# EasyEDA schematic 1-Schematic_Volumetric_Display.json
TITLE: Volumetric LED Matrix; REV: 1.0; Date: 2025-08-06; Sheet: 1/1; Drawn By: MoritzK; Company: Samsung Energy
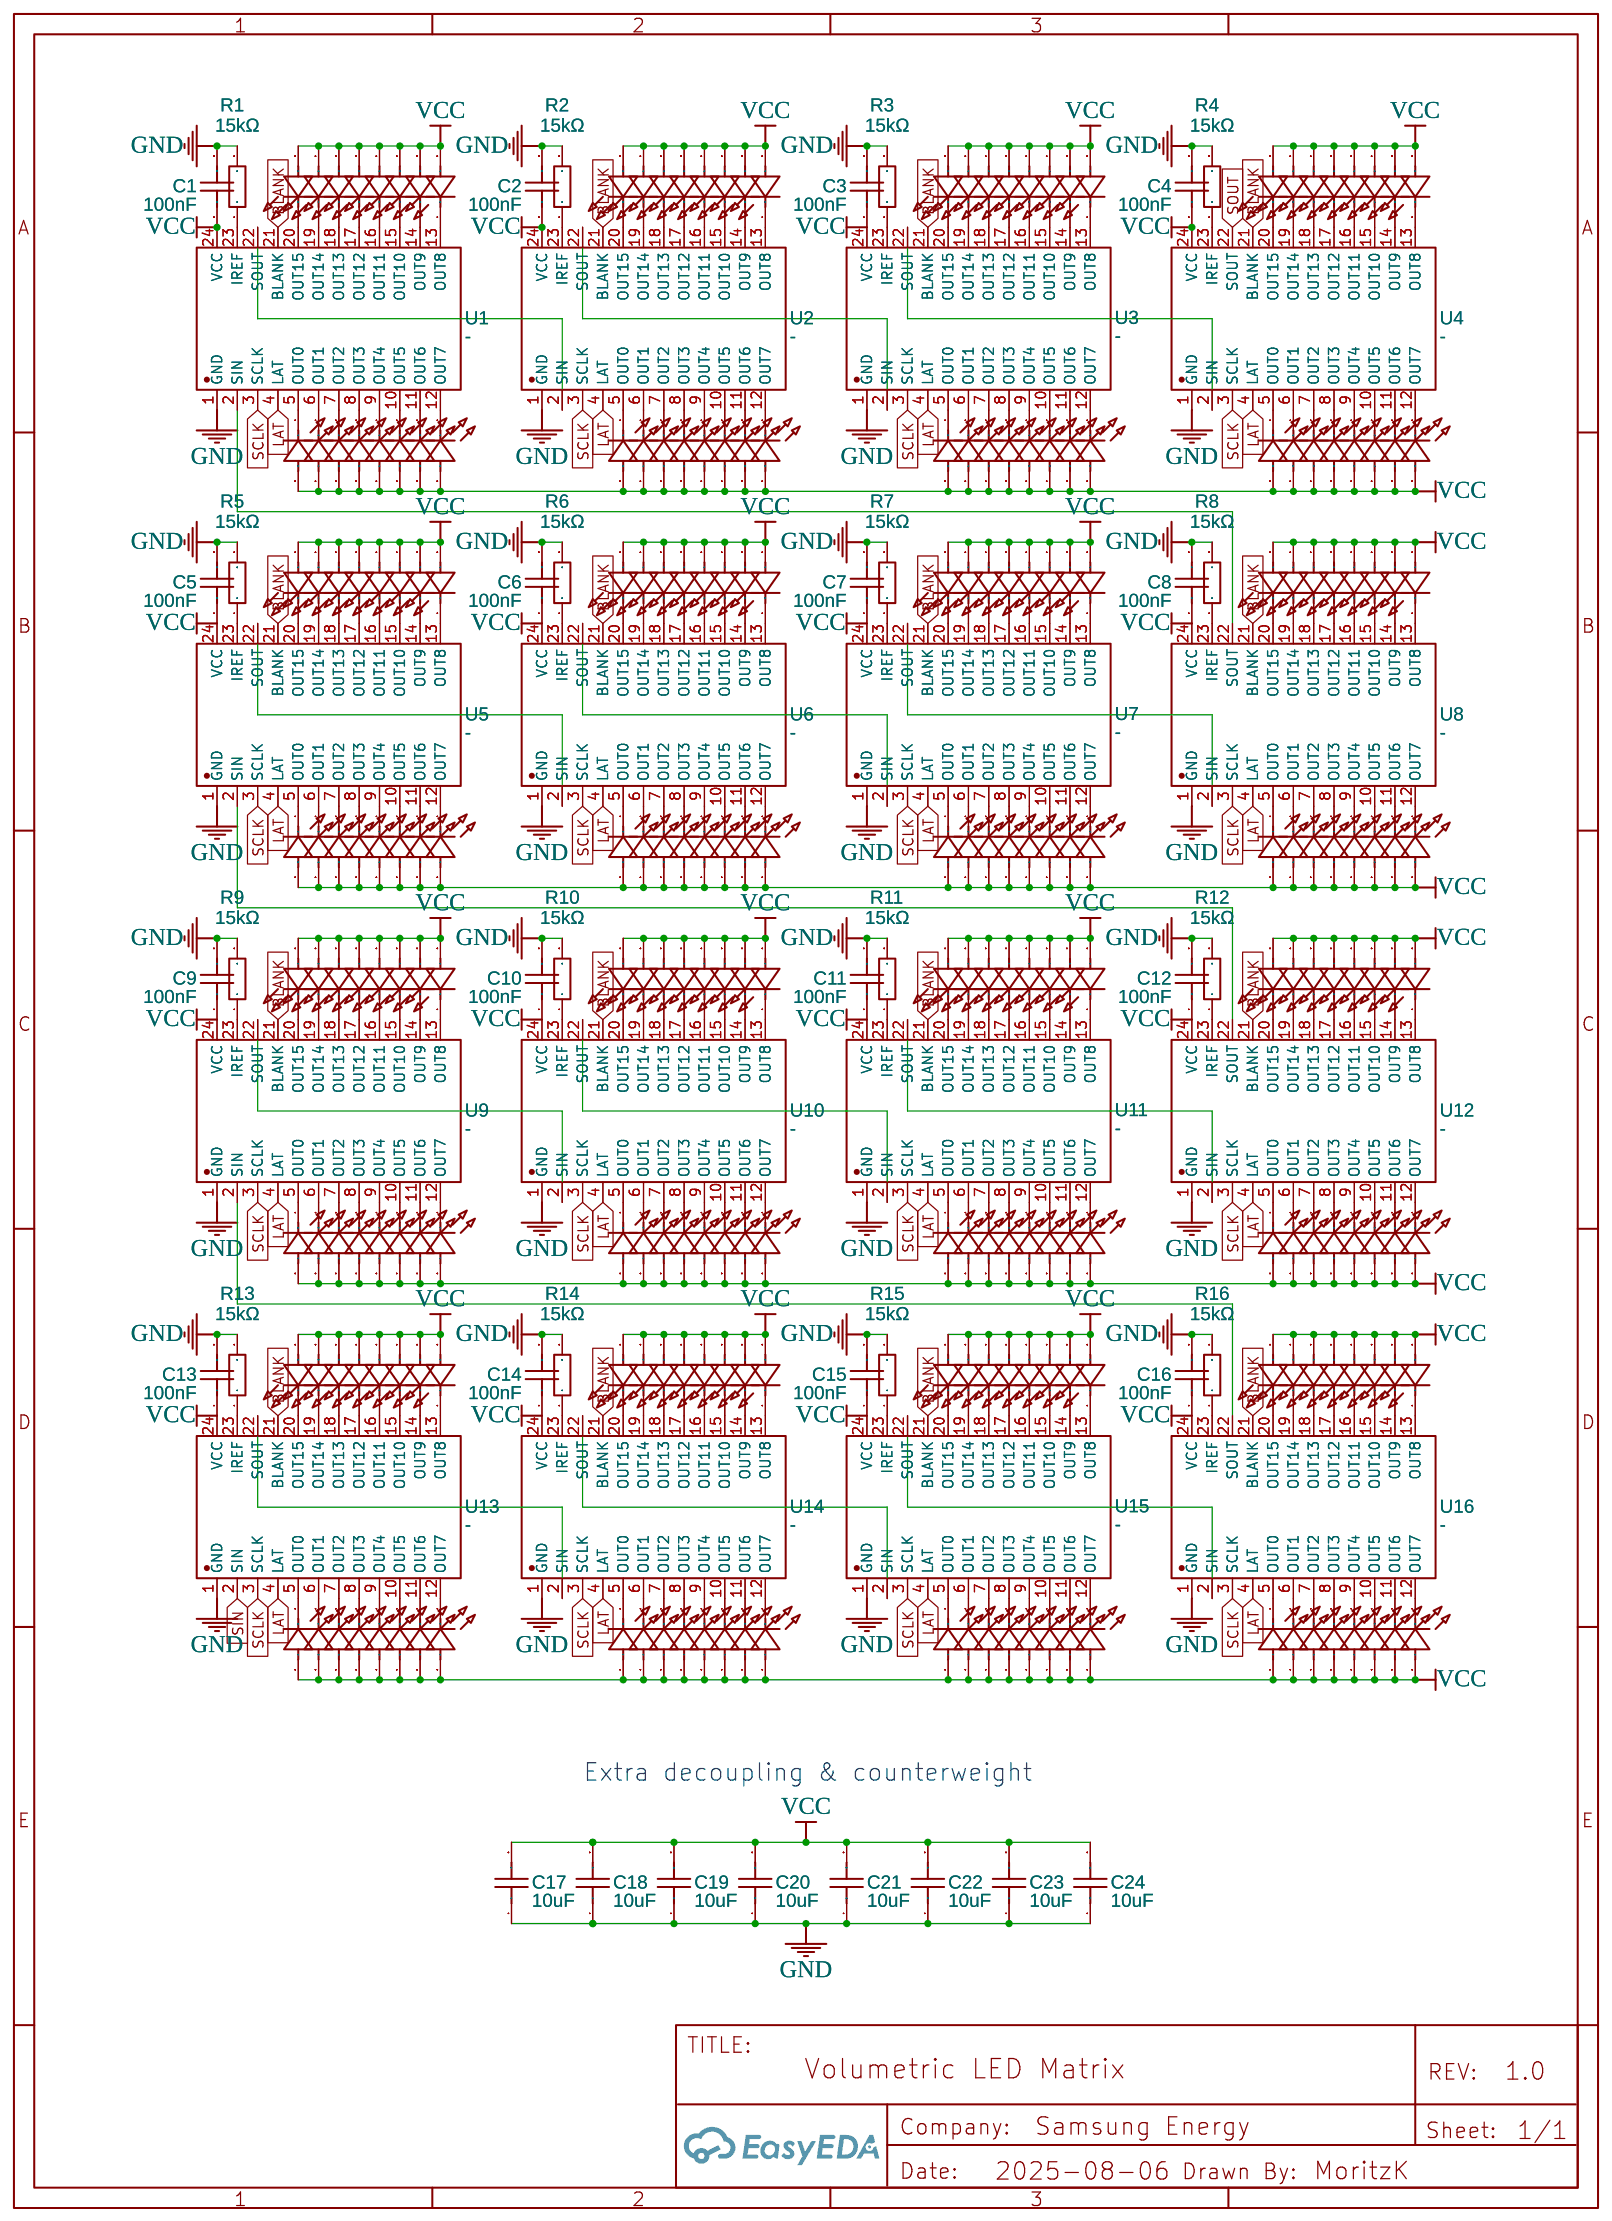
[diagram p0: schematic sheet]

## Parts
C1  100nF  [C0603]
C2  100nF  [C0603]
C3  100nF  [C0603]
C4  100nF  [C0603]
C5  100nF  [C0603]
C6  100nF  [C0603]
C7  100nF  [C0603]
C8  100nF  [C0603]
C9  100nF  [C0603]
C10  100nF  [C0603]
C11  100nF  [C0603]
C12  100nF  [C0603]
C13  100nF  [C0603]
C14  100nF  [C0603]
C15  100nF  [C0603]
C16  100nF  [C0603]
C17  10uF  [C0603]
C18  10uF  [C0603]
C19  10uF  [C0603]
C20  10uF  [C0603]
C21  10uF  [C0603]
C22  10uF  [C0603]
C23  10uF  [C0603]
C24  10uF  [C0603]
LED1  F.0603.00106/P2-0603W7YS2-06T-001  [LED0603-RD]
LED2  F.0603.00106/P2-0603W7YS2-06T-001  [LED0603-RD]
LED3  F.0603.00106/P2-0603W7YS2-06T-001  [LED0603-RD]
LED4  F.0603.00106/P2-0603W7YS2-06T-001  [LED0603-RD]
LED5  F.0603.00106/P2-0603W7YS2-06T-001  [LED0603-RD]
LED6  F.0603.00106/P2-0603W7YS2-06T-001  [LED0603-RD]
LED7  F.0603.00106/P2-0603W7YS2-06T-001  [LED0603-RD]
LED8  F.0603.00106/P2-0603W7YS2-06T-001  [LED0603-RD]
LED9  F.0603.00106/P2-0603W7YS2-06T-001  [LED0603-RD]
LED10  F.0603.00106/P2-0603W7YS2-06T-001  [LED0603-RD]
LED11  F.0603.00106/P2-0603W7YS2-06T-001  [LED0603-RD]
LED12  F.0603.00106/P2-0603W7YS2-06T-001  [LED0603-RD]
LED13  F.0603.00106/P2-0603W7YS2-06T-001  [LED0603-RD]
LED14  F.0603.00106/P2-0603W7YS2-06T-001  [LED0603-RD]
LED15  F.0603.00106/P2-0603W7YS2-06T-001  [LED0603-RD]
LED16  F.0603.00106/P2-0603W7YS2-06T-001  [LED0603-RD]
LED17  F.0603.00106/P2-0603W7YS2-06T-001  [LED0603-RD]
LED18  F.0603.00106/P2-0603W7YS2-06T-001  [LED0603-RD]
LED19  F.0603.00106/P2-0603W7YS2-06T-001  [LED0603-RD]
LED20  F.0603.00106/P2-0603W7YS2-06T-001  [LED0603-RD]
LED21  F.0603.00106/P2-0603W7YS2-06T-001  [LED0603-RD]
LED22  F.0603.00106/P2-0603W7YS2-06T-001  [LED0603-RD]
LED23  F.0603.00106/P2-0603W7YS2-06T-001  [LED0603-RD]
LED24  F.0603.00106/P2-0603W7YS2-06T-001  [LED0603-RD]
LED25  F.0603.00106/P2-0603W7YS2-06T-001  [LED0603-RD]
LED26  F.0603.00106/P2-0603W7YS2-06T-001  [LED0603-RD]
LED27  F.0603.00106/P2-0603W7YS2-06T-001  [LED0603-RD]
LED28  F.0603.00106/P2-0603W7YS2-06T-001  [LED0603-RD]
LED29  F.0603.00106/P2-0603W7YS2-06T-001  [LED0603-RD]
LED30  F.0603.00106/P2-0603W7YS2-06T-001  [LED0603-RD]
LED31  F.0603.00106/P2-0603W7YS2-06T-001  [LED0603-RD]
LED32  F.0603.00106/P2-0603W7YS2-06T-001  [LED0603-RD]
LED33  F.0603.00106/P2-0603W7YS2-06T-001  [LED0603-RD]
LED34  F.0603.00106/P2-0603W7YS2-06T-001  [LED0603-RD]
LED35  F.0603.00106/P2-0603W7YS2-06T-001  [LED0603-RD]
LED36  F.0603.00106/P2-0603W7YS2-06T-001  [LED0603-RD]
LED37  F.0603.00106/P2-0603W7YS2-06T-001  [LED0603-RD]
LED38  F.0603.00106/P2-0603W7YS2-06T-001  [LED0603-RD]
LED39  F.0603.00106/P2-0603W7YS2-06T-001  [LED0603-RD]
LED40  F.0603.00106/P2-0603W7YS2-06T-001  [LED0603-RD]
LED41  F.0603.00106/P2-0603W7YS2-06T-001  [LED0603-RD]
LED42  F.0603.00106/P2-0603W7YS2-06T-001  [LED0603-RD]
LED43  F.0603.00106/P2-0603W7YS2-06T-001  [LED0603-RD]
LED44  F.0603.00106/P2-0603W7YS2-06T-001  [LED0603-RD]
LED45  F.0603.00106/P2-0603W7YS2-06T-001  [LED0603-RD]
LED46  F.0603.00106/P2-0603W7YS2-06T-001  [LED0603-RD]
LED47  F.0603.00106/P2-0603W7YS2-06T-001  [LED0603-RD]
LED48  F.0603.00106/P2-0603W7YS2-06T-001  [LED0603-RD]
LED49  F.0603.00106/P2-0603W7YS2-06T-001  [LED0603-RD]
LED50  F.0603.00106/P2-0603W7YS2-06T-001  [LED0603-RD]
LED51  F.0603.00106/P2-0603W7YS2-06T-001  [LED0603-RD]
LED52  F.0603.00106/P2-0603W7YS2-06T-001  [LED0603-RD]
LED53  F.0603.00106/P2-0603W7YS2-06T-001  [LED0603-RD]
LED54  F.0603.00106/P2-0603W7YS2-06T-001  [LED0603-RD]
LED55  F.0603.00106/P2-0603W7YS2-06T-001  [LED0603-RD]
LED56  F.0603.00106/P2-0603W7YS2-06T-001  [LED0603-RD]
LED57  F.0603.00106/P2-0603W7YS2-06T-001  [LED0603-RD]
LED58  F.0603.00106/P2-0603W7YS2-06T-001  [LED0603-RD]
LED59  F.0603.00106/P2-0603W7YS2-06T-001  [LED0603-RD]
LED60  F.0603.00106/P2-0603W7YS2-06T-001  [LED0603-RD]
LED61  F.0603.00106/P2-0603W7YS2-06T-001  [LED0603-RD]
LED62  F.0603.00106/P2-0603W7YS2-06T-001  [LED0603-RD]
LED63  F.0603.00106/P2-0603W7YS2-06T-001  [LED0603-RD]
LED64  F.0603.00106/P2-0603W7YS2-06T-001  [LED0603-RD]
LED65  F.0603.00106/P2-0603W7YS2-06T-001  [LED0603-RD]
LED66  F.0603.00106/P2-0603W7YS2-06T-001  [LED0603-RD]
LED67  F.0603.00106/P2-0603W7YS2-06T-001  [LED0603-RD]
LED68  F.0603.00106/P2-0603W7YS2-06T-001  [LED0603-RD]
LED69  F.0603.00106/P2-0603W7YS2-06T-001  [LED0603-RD]
LED70  F.0603.00106/P2-0603W7YS2-06T-001  [LED0603-RD]
LED71  F.0603.00106/P2-0603W7YS2-06T-001  [LED0603-RD]
LED72  F.0603.00106/P2-0603W7YS2-06T-001  [LED0603-RD]
LED73  F.0603.00106/P2-0603W7YS2-06T-001  [LED0603-RD]
LED74  F.0603.00106/P2-0603W7YS2-06T-001  [LED0603-RD]
LED75  F.0603.00106/P2-0603W7YS2-06T-001  [LED0603-RD]
LED76  F.0603.00106/P2-0603W7YS2-06T-001  [LED0603-RD]
LED77  F.0603.00106/P2-0603W7YS2-06T-001  [LED0603-RD]
LED78  F.0603.00106/P2-0603W7YS2-06T-001  [LED0603-RD]
LED79  F.0603.00106/P2-0603W7YS2-06T-001  [LED0603-RD]
LED80  F.0603.00106/P2-0603W7YS2-06T-001  [LED0603-RD]
LED81  F.0603.00106/P2-0603W7YS2-06T-001  [LED0603-RD]
LED82  F.0603.00106/P2-0603W7YS2-06T-001  [LED0603-RD]
LED83  F.0603.00106/P2-0603W7YS2-06T-001  [LED0603-RD]
LED84  F.0603.00106/P2-0603W7YS2-06T-001  [LED0603-RD]
LED85  F.0603.00106/P2-0603W7YS2-06T-001  [LED0603-RD]
LED86  F.0603.00106/P2-0603W7YS2-06T-001  [LED0603-RD]
LED87  F.0603.00106/P2-0603W7YS2-06T-001  [LED0603-RD]
LED88  F.0603.00106/P2-0603W7YS2-06T-001  [LED0603-RD]
LED89  F.0603.00106/P2-0603W7YS2-06T-001  [LED0603-RD]
LED90  F.0603.00106/P2-0603W7YS2-06T-001  [LED0603-RD]
LED91  F.0603.00106/P2-0603W7YS2-06T-001  [LED0603-RD]
LED92  F.0603.00106/P2-0603W7YS2-06T-001  [LED0603-RD]
LED93  F.0603.00106/P2-0603W7YS2-06T-001  [LED0603-RD]
LED94  F.0603.00106/P2-0603W7YS2-06T-001  [LED0603-RD]
LED95  F.0603.00106/P2-0603W7YS2-06T-001  [LED0603-RD]
LED96  F.0603.00106/P2-0603W7YS2-06T-001  [LED0603-RD]
LED97  F.0603.00106/P2-0603W7YS2-06T-001  [LED0603-RD]
LED98  F.0603.00106/P2-0603W7YS2-06T-001  [LED0603-RD]
LED99  F.0603.00106/P2-0603W7YS2-06T-001  [LED0603-RD]
LED100  F.0603.00106/P2-0603W7YS2-06T-001  [LED0603-RD]
LED101  F.0603.00106/P2-0603W7YS2-06T-001  [LED0603-RD]
LED102  F.0603.00106/P2-0603W7YS2-06T-001  [LED0603-RD]
LED103  F.0603.00106/P2-0603W7YS2-06T-001  [LED0603-RD]
LED104  F.0603.00106/P2-0603W7YS2-06T-001  [LED0603-RD]
LED105  F.0603.00106/P2-0603W7YS2-06T-001  [LED0603-RD]
LED106  F.0603.00106/P2-0603W7YS2-06T-001  [LED0603-RD]
LED107  F.0603.00106/P2-0603W7YS2-06T-001  [LED0603-RD]
LED108  F.0603.00106/P2-0603W7YS2-06T-001  [LED0603-RD]
LED109  F.0603.00106/P2-0603W7YS2-06T-001  [LED0603-RD]
LED110  F.0603.00106/P2-0603W7YS2-06T-001  [LED0603-RD]
LED111  F.0603.00106/P2-0603W7YS2-06T-001  [LED0603-RD]
LED112  F.0603.00106/P2-0603W7YS2-06T-001  [LED0603-RD]
LED113  F.0603.00106/P2-0603W7YS2-06T-001  [LED0603-RD]
LED114  F.0603.00106/P2-0603W7YS2-06T-001  [LED0603-RD]
LED115  F.0603.00106/P2-0603W7YS2-06T-001  [LED0603-RD]
LED116  F.0603.00106/P2-0603W7YS2-06T-001  [LED0603-RD]
LED117  F.0603.00106/P2-0603W7YS2-06T-001  [LED0603-RD]
LED118  F.0603.00106/P2-0603W7YS2-06T-001  [LED0603-RD]
LED119  F.0603.00106/P2-0603W7YS2-06T-001  [LED0603-RD]
LED120  F.0603.00106/P2-0603W7YS2-06T-001  [LED0603-RD]
LED121  F.0603.00106/P2-0603W7YS2-06T-001  [LED0603-RD]
LED122  F.0603.00106/P2-0603W7YS2-06T-001  [LED0603-RD]
LED123  F.0603.00106/P2-0603W7YS2-06T-001  [LED0603-RD]
LED124  F.0603.00106/P2-0603W7YS2-06T-001  [LED0603-RD]
LED125  F.0603.00106/P2-0603W7YS2-06T-001  [LED0603-RD]
LED126  F.0603.00106/P2-0603W7YS2-06T-001  [LED0603-RD]
LED127  F.0603.00106/P2-0603W7YS2-06T-001  [LED0603-RD]
LED128  F.0603.00106/P2-0603W7YS2-06T-001  [LED0603-RD]
LED129  F.0603.00106/P2-0603W7YS2-06T-001  [LED0603-RD]
LED130  F.0603.00106/P2-0603W7YS2-06T-001  [LED0603-RD]
LED131  F.0603.00106/P2-0603W7YS2-06T-001  [LED0603-RD]
LED132  F.0603.00106/P2-0603W7YS2-06T-001  [LED0603-RD]
LED133  F.0603.00106/P2-0603W7YS2-06T-001  [LED0603-RD]
LED134  F.0603.00106/P2-0603W7YS2-06T-001  [LED0603-RD]
LED135  F.0603.00106/P2-0603W7YS2-06T-001  [LED0603-RD]
LED136  F.0603.00106/P2-0603W7YS2-06T-001  [LED0603-RD]
LED137  F.0603.00106/P2-0603W7YS2-06T-001  [LED0603-RD]
LED138  F.0603.00106/P2-0603W7YS2-06T-001  [LED0603-RD]
LED139  F.0603.00106/P2-0603W7YS2-06T-001  [LED0603-RD]
LED140  F.0603.00106/P2-0603W7YS2-06T-001  [LED0603-RD]
LED141  F.0603.00106/P2-0603W7YS2-06T-001  [LED0603-RD]
LED142  F.0603.00106/P2-0603W7YS2-06T-001  [LED0603-RD]
LED143  F.0603.00106/P2-0603W7YS2-06T-001  [LED0603-RD]
LED144  F.0603.00106/P2-0603W7YS2-06T-001  [LED0603-RD]
LED145  F.0603.00106/P2-0603W7YS2-06T-001  [LED0603-RD]
LED146  F.0603.00106/P2-0603W7YS2-06T-001  [LED0603-RD]
LED147  F.0603.00106/P2-0603W7YS2-06T-001  [LED0603-RD]
LED148  F.0603.00106/P2-0603W7YS2-06T-001  [LED0603-RD]
LED149  F.0603.00106/P2-0603W7YS2-06T-001  [LED0603-RD]
LED150  F.0603.00106/P2-0603W7YS2-06T-001  [LED0603-RD]
LED151  F.0603.00106/P2-0603W7YS2-06T-001  [LED0603-RD]
LED152  F.0603.00106/P2-0603W7YS2-06T-001  [LED0603-RD]
LED153  F.0603.00106/P2-0603W7YS2-06T-001  [LED0603-RD]
LED154  F.0603.00106/P2-0603W7YS2-06T-001  [LED0603-RD]
LED155  F.0603.00106/P2-0603W7YS2-06T-001  [LED0603-RD]
LED156  F.0603.00106/P2-0603W7YS2-06T-001  [LED0603-RD]
LED157  F.0603.00106/P2-0603W7YS2-06T-001  [LED0603-RD]
LED158  F.0603.00106/P2-0603W7YS2-06T-001  [LED0603-RD]
LED159  F.0603.00106/P2-0603W7YS2-06T-001  [LED0603-RD]
LED160  F.0603.00106/P2-0603W7YS2-06T-001  [LED0603-RD]
LED161  F.0603.00106/P2-0603W7YS2-06T-001  [LED0603-RD]
LED162  F.0603.00106/P2-0603W7YS2-06T-001  [LED0603-RD]
LED163  F.0603.00106/P2-0603W7YS2-06T-001  [LED0603-RD]
LED164  F.0603.00106/P2-0603W7YS2-06T-001  [LED0603-RD]
LED165  F.0603.00106/P2-0603W7YS2-06T-001  [LED0603-RD]
LED166  F.0603.00106/P2-0603W7YS2-06T-001  [LED0603-RD]
LED167  F.0603.00106/P2-0603W7YS2-06T-001  [LED0603-RD]
LED168  F.0603.00106/P2-0603W7YS2-06T-001  [LED0603-RD]
LED169  F.0603.00106/P2-0603W7YS2-06T-001  [LED0603-RD]
LED170  F.0603.00106/P2-0603W7YS2-06T-001  [LED0603-RD]
LED171  F.0603.00106/P2-0603W7YS2-06T-001  [LED0603-RD]
LED172  F.0603.00106/P2-0603W7YS2-06T-001  [LED0603-RD]
LED173  F.0603.00106/P2-0603W7YS2-06T-001  [LED0603-RD]
LED174  F.0603.00106/P2-0603W7YS2-06T-001  [LED0603-RD]
LED175  F.0603.00106/P2-0603W7YS2-06T-001  [LED0603-RD]
LED176  F.0603.00106/P2-0603W7YS2-06T-001  [LED0603-RD]
LED177  F.0603.00106/P2-0603W7YS2-06T-001  [LED0603-RD]
LED178  F.0603.00106/P2-0603W7YS2-06T-001  [LED0603-RD]
LED179  F.0603.00106/P2-0603W7YS2-06T-001  [LED0603-RD]
LED180  F.0603.00106/P2-0603W7YS2-06T-001  [LED0603-RD]
LED181  F.0603.00106/P2-0603W7YS2-06T-001  [LED0603-RD]
LED182  F.0603.00106/P2-0603W7YS2-06T-001  [LED0603-RD]
LED183  F.0603.00106/P2-0603W7YS2-06T-001  [LED0603-RD]
LED184  F.0603.00106/P2-0603W7YS2-06T-001  [LED0603-RD]
LED185  F.0603.00106/P2-0603W7YS2-06T-001  [LED0603-RD]
LED186  F.0603.00106/P2-0603W7YS2-06T-001  [LED0603-RD]
LED187  F.0603.00106/P2-0603W7YS2-06T-001  [LED0603-RD]
LED188  F.0603.00106/P2-0603W7YS2-06T-001  [LED0603-RD]
LED189  F.0603.00106/P2-0603W7YS2-06T-001  [LED0603-RD]
LED190  F.0603.00106/P2-0603W7YS2-06T-001  [LED0603-RD]
LED191  F.0603.00106/P2-0603W7YS2-06T-001  [LED0603-RD]
LED192  F.0603.00106/P2-0603W7YS2-06T-001  [LED0603-RD]
LED193  F.0603.00106/P2-0603W7YS2-06T-001  [LED0603-RD]
LED194  F.0603.00106/P2-0603W7YS2-06T-001  [LED0603-RD]
LED195  F.0603.00106/P2-0603W7YS2-06T-001  [LED0603-RD]
LED196  F.0603.00106/P2-0603W7YS2-06T-001  [LED0603-RD]
LED197  F.0603.00106/P2-0603W7YS2-06T-001  [LED0603-RD]
LED198  F.0603.00106/P2-0603W7YS2-06T-001  [LED0603-RD]
LED199  F.0603.00106/P2-0603W7YS2-06T-001  [LED0603-RD]
LED200  F.0603.00106/P2-0603W7YS2-06T-001  [LED0603-RD]
LED201  F.0603.00106/P2-0603W7YS2-06T-001  [LED0603-RD]
LED202  F.0603.00106/P2-0603W7YS2-06T-001  [LED0603-RD]
LED203  F.0603.00106/P2-0603W7YS2-06T-001  [LED0603-RD]
LED204  F.0603.00106/P2-0603W7YS2-06T-001  [LED0603-RD]
LED205  F.0603.00106/P2-0603W7YS2-06T-001  [LED0603-RD]
LED206  F.0603.00106/P2-0603W7YS2-06T-001  [LED0603-RD]
LED207  F.0603.00106/P2-0603W7YS2-06T-001  [LED0603-RD]
LED208  F.0603.00106/P2-0603W7YS2-06T-001  [LED0603-RD]
LED209  F.0603.00106/P2-0603W7YS2-06T-001  [LED0603-RD]
LED210  F.0603.00106/P2-0603W7YS2-06T-001  [LED0603-RD]
LED211  F.0603.00106/P2-0603W7YS2-06T-001  [LED0603-RD]
LED212  F.0603.00106/P2-0603W7YS2-06T-001  [LED0603-RD]
LED213  F.0603.00106/P2-0603W7YS2-06T-001  [LED0603-RD]
LED214  F.0603.00106/P2-0603W7YS2-06T-001  [LED0603-RD]
LED215  F.0603.00106/P2-0603W7YS2-06T-001  [LED0603-RD]
LED216  F.0603.00106/P2-0603W7YS2-06T-001  [LED0603-RD]
LED217  F.0603.00106/P2-0603W7YS2-06T-001  [LED0603-RD]
LED218  F.0603.00106/P2-0603W7YS2-06T-001  [LED0603-RD]
LED219  F.0603.00106/P2-0603W7YS2-06T-001  [LED0603-RD]
LED220  F.0603.00106/P2-0603W7YS2-06T-001  [LED0603-RD]
LED221  F.0603.00106/P2-0603W7YS2-06T-001  [LED0603-RD]
LED222  F.0603.00106/P2-0603W7YS2-06T-001  [LED0603-RD]
LED223  F.0603.00106/P2-0603W7YS2-06T-001  [LED0603-RD]
LED224  F.0603.00106/P2-0603W7YS2-06T-001  [LED0603-RD]
LED225  F.0603.00106/P2-0603W7YS2-06T-001  [LED0603-RD]
LED226  F.0603.00106/P2-0603W7YS2-06T-001  [LED0603-RD]
LED227  F.0603.00106/P2-0603W7YS2-06T-001  [LED0603-RD]
LED228  F.0603.00106/P2-0603W7YS2-06T-001  [LED0603-RD]
LED229  F.0603.00106/P2-0603W7YS2-06T-001  [LED0603-RD]
LED230  F.0603.00106/P2-0603W7YS2-06T-001  [LED0603-RD]
LED231  F.0603.00106/P2-0603W7YS2-06T-001  [LED0603-RD]
LED232  F.0603.00106/P2-0603W7YS2-06T-001  [LED0603-RD]
LED233  F.0603.00106/P2-0603W7YS2-06T-001  [LED0603-RD]
LED234  F.0603.00106/P2-0603W7YS2-06T-001  [LED0603-RD]
LED235  F.0603.00106/P2-0603W7YS2-06T-001  [LED0603-RD]
LED236  F.0603.00106/P2-0603W7YS2-06T-001  [LED0603-RD]
LED237  F.0603.00106/P2-0603W7YS2-06T-001  [LED0603-RD]
LED238  F.0603.00106/P2-0603W7YS2-06T-001  [LED0603-RD]
LED239  F.0603.00106/P2-0603W7YS2-06T-001  [LED0603-RD]
LED240  F.0603.00106/P2-0603W7YS2-06T-001  [LED0603-RD]
LED241  F.0603.00106/P2-0603W7YS2-06T-001  [LED0603-RD]
LED242  F.0603.00106/P2-0603W7YS2-06T-001  [LED0603-RD]
LED243  F.0603.00106/P2-0603W7YS2-06T-001  [LED0603-RD]
LED244  F.0603.00106/P2-0603W7YS2-06T-001  [LED0603-RD]
LED245  F.0603.00106/P2-0603W7YS2-06T-001  [LED0603-RD]
LED246  F.0603.00106/P2-0603W7YS2-06T-001  [LED0603-RD]
LED247  F.0603.00106/P2-0603W7YS2-06T-001  [LED0603-RD]
LED248  F.0603.00106/P2-0603W7YS2-06T-001  [LED0603-RD]
LED249  F.0603.00106/P2-0603W7YS2-06T-001  [LED0603-RD]
LED250  F.0603.00106/P2-0603W7YS2-06T-001  [LED0603-RD]
LED251  F.0603.00106/P2-0603W7YS2-06T-001  [LED0603-RD]
LED252  F.0603.00106/P2-0603W7YS2-06T-001  [LED0603-RD]
LED253  F.0603.00106/P2-0603W7YS2-06T-001  [LED0603-RD]
LED254  F.0603.00106/P2-0603W7YS2-06T-001  [LED0603-RD]
LED255  F.0603.00106/P2-0603W7YS2-06T-001  [LED0603-RD]
LED256  F.0603.00106/P2-0603W7YS2-06T-001  [LED0603-RD]
R1  15kΩ  [R0603]
R2  15kΩ  [R0603]
R3  15kΩ  [R0603]
R4  15kΩ  [R0603]
R5  15kΩ  [R0603]
R6  15kΩ  [R0603]
R7  15kΩ  [R0603]
R8  15kΩ  [R0603]
R9  15kΩ  [R0603]
R10  15kΩ  [R0603]
R11  15kΩ  [R0603]
R12  15kΩ  [R0603]
R13  15kΩ  [R0603]
R14  15kΩ  [R0603]
R15  15kΩ  [R0603]
R16  15kΩ  [R0603]
U1  -  [SSOP-24_L8.7-W3.9-P0.64-LS6.0-BL]
U2  -  [SSOP-24_L8.7-W3.9-P0.64-LS6.0-BL]
U3  -  [SSOP-24_L8.7-W3.9-P0.64-LS6.0-BL]
U4  -  [SSOP-24_L8.7-W3.9-P0.64-LS6.0-BL]
U5  -  [SSOP-24_L8.7-W3.9-P0.64-LS6.0-BL]
U6  -  [SSOP-24_L8.7-W3.9-P0.64-LS6.0-BL]
U7  -  [SSOP-24_L8.7-W3.9-P0.64-LS6.0-BL]
U8  -  [SSOP-24_L8.7-W3.9-P0.64-LS6.0-BL]
U9  -  [SSOP-24_L8.7-W3.9-P0.64-LS6.0-BL]
U10  -  [SSOP-24_L8.7-W3.9-P0.64-LS6.0-BL]
U11  -  [SSOP-24_L8.7-W3.9-P0.64-LS6.0-BL]
U12  -  [SSOP-24_L8.7-W3.9-P0.64-LS6.0-BL]
U13  -  [SSOP-24_L8.7-W3.9-P0.64-LS6.0-BL]
U14  -  [SSOP-24_L8.7-W3.9-P0.64-LS6.0-BL]
U15  -  [SSOP-24_L8.7-W3.9-P0.64-LS6.0-BL]
U16  -  [SSOP-24_L8.7-W3.9-P0.64-LS6.0-BL]

## Library data of the parts
C1-C16 = CC0603KRX7R9BB104: Supplier: LCSC; Manufacturer: YAGEO(国巨); Supplier Part: C14663; JLCPCB Part Class: Basic Part
C17-C24 = CL10A106KP8NNNC: Supplier: LCSC; Manufacturer: SAMSUNG(三星); Supplier Part: C19702; JLCPCB Part Class: Basic Part
LED1-LED256 = F.0603.00106/P2-0603W7YS2-06T-001: Supplier: LCSC; Supplier Part: C7496831; Manufacturer: TUOZHAN(拓展光电); Contributor: lcsc; JLCPCB Part Class: Extended Part
R1-R16 = 0603WAF1502T5E: Supplier: LCSC; Manufacturer: UNI-ROYAL(厚声); Supplier Part: C22809; JLCPCB Part Class: Basic Part
U1-U16 = TLC59283DBQR: Contributor: LCSC; Supplier: LCSC; Supplier Part: C702075; Manufacturer: TI(德州仪器); JLCPCB Part Class: Extended Part

## Nets
GND: C1.2 C2.2 C3.2 C4.2 C5.2 C6.2 C7.2 C8.2 C9.2 C10.2 C11.2 C12.2 C13.2 C14.2 C15.2 C16.2 C17.1 C18.1 C19.1 C20.1 C21.1 C22.1 C23.1 C24.1 R1.2 R2.2 R3.2 R4.2 R5.2 R6.2 R7.2 R8.2 R9.2 R10.2 R11.2 R12.2 R13.2 R14.2 R15.2 R16.2 U1.1(GND) U2.1(GND) U3.1(GND) U4.1(GND) U5.1(GND) U6.1(GND) U7.1(GND) U8.1(GND) U9.1(GND) U10.1(GND) U11.1(GND) U12.1(GND) U13.1(GND) U14.1(GND) U15.1(GND) U16.1(GND)
VCC: C1.1 C2.1 C3.1 C4.1 C5.1 C6.1 C7.1 C8.1 C9.1 C10.1 C11.1 C12.1 C13.1 C14.1 C15.1 C16.1 C17.2 C18.2 C19.2 C20.2 C21.2 C22.2 C23.2 C24.2 LED1.2(A) LED2.2(A) LED3.2(A) LED4.2(A) LED5.2(A) LED6.2(A) LED7.2(A) LED8.2(A) LED9.2(A) LED10.2(A) LED11.2(A) LED12.2(A) LED13.2(A) LED14.2(A) LED15.2(A) LED16.2(A) LED17.2(A) LED18.2(A) LED19.2(A) LED20.2(A) LED21.2(A) LED22.2(A) LED23.2(A) LED24.2(A) LED25.2(A) LED26.2(A) LED27.2(A) LED28.2(A) LED29.2(A) LED30.2(A) LED31.2(A) LED32.2(A) LED33.2(A) LED34.2(A) LED35.2(A) LED36.2(A) LED37.2(A) LED38.2(A) LED39.2(A) LED40.2(A) LED41.2(A) LED42.2(A) LED43.2(A) LED44.2(A) LED45.2(A) LED46.2(A) LED47.2(A) LED48.2(A) LED49.2(A) LED50.2(A) LED51.2(A) LED52.2(A) LED53.2(A) LED54.2(A) LED55.2(A) LED56.2(A) LED57.2(A) LED58.2(A) LED59.2(A) LED60.2(A) LED61.2(A) LED62.2(A) LED63.2(A) LED64.2(A) LED65.2(A) LED66.2(A) LED67.2(A) LED68.2(A) LED69.2(A) LED70.2(A) LED71.2(A) LED72.2(A) LED73.2(A) LED74.2(A) LED75.2(A) LED76.2(A) LED77.2(A) LED78.2(A) LED79.2(A) LED80.2(A) LED81.2(A) LED82.2(A) LED83.2(A) LED84.2(A) LED85.2(A) LED86.2(A) LED87.2(A) LED88.2(A) LED89.2(A) LED90.2(A) LED91.2(A) LED92.2(A) LED93.2(A) LED94.2(A) LED95.2(A) LED96.2(A) LED97.2(A) LED98.2(A) LED99.2(A) LED100.2(A) LED101.2(A) LED102.2(A) LED103.2(A) LED104.2(A) LED105.2(A) LED106.2(A) LED107.2(A) LED108.2(A) LED109.2(A) LED110.2(A) LED111.2(A) LED112.2(A) LED113.2(A) LED114.2(A) LED115.2(A) LED116.2(A) LED117.2(A) LED118.2(A) LED119.2(A) LED120.2(A) LED121.2(A) LED122.2(A) LED123.2(A) LED124.2(A) LED125.2(A) LED126.2(A) LED127.2(A) LED128.2(A) LED129.2(A) LED130.2(A) LED131.2(A) LED132.2(A) LED133.2(A) LED134.2(A) LED135.2(A) LED136.2(A) LED137.2(A) LED138.2(A) LED139.2(A) LED140.2(A) LED141.2(A) LED142.2(A) LED143.2(A) LED144.2(A) LED145.2(A) LED146.2(A) LED147.2(A) LED148.2(A) LED149.2(A) LED150.2(A) LED151.2(A) LED152.2(A) LED153.2(A) LED154.2(A) LED155.2(A) LED156.2(A) LED157.2(A) LED158.2(A) LED159.2(A) LED160.2(A) LED161.2(A) LED162.2(A) LED163.2(A) LED164.2(A) LED165.2(A) LED166.2(A) LED167.2(A) LED168.2(A) LED169.2(A) LED170.2(A) LED171.2(A) LED172.2(A) LED173.2(A) LED174.2(A) LED175.2(A) LED176.2(A) LED177.2(A) LED178.2(A) LED179.2(A) LED180.2(A) LED181.2(A) LED182.2(A) LED183.2(A) LED184.2(A) LED185.2(A) LED186.2(A) LED187.2(A) LED188.2(A) LED189.2(A) LED190.2(A) LED191.2(A) LED192.2(A) LED193.2(A) LED194.2(A) LED195.2(A) LED196.2(A) LED197.2(A) LED198.2(A) LED199.2(A) LED200.2(A) LED201.2(A) LED202.2(A) LED203.2(A) LED204.2(A) LED205.2(A) LED206.2(A) LED207.2(A) LED208.2(A) LED209.2(A) LED210.2(A) LED211.2(A) LED212.2(A) LED213.2(A) LED214.2(A) LED215.2(A) LED216.2(A) LED217.2(A) LED218.2(A) LED219.2(A) LED220.2(A) LED221.2(A) LED222.2(A) LED223.2(A) LED224.2(A) LED225.2(A) LED226.2(A) LED227.2(A) LED228.2(A) LED229.2(A) LED230.2(A) LED231.2(A) LED232.2(A) LED233.2(A) LED234.2(A) LED235.2(A) LED236.2(A) LED237.2(A) LED238.2(A) LED239.2(A) LED240.2(A) LED241.2(A) LED242.2(A) LED243.2(A) LED244.2(A) LED245.2(A) LED246.2(A) LED247.2(A) LED248.2(A) LED249.2(A) LED250.2(A) LED251.2(A) LED252.2(A) LED253.2(A) LED254.2(A) LED255.2(A) LED256.2(A) U1.24(VCC) U2.24(VCC) U3.24(VCC) U4.24(VCC) U5.24(VCC) U6.24(VCC) U7.24(VCC) U8.24(VCC) U9.24(VCC) U10.24(VCC) U11.24(VCC) U12.24(VCC) U13.24(VCC) U14.24(VCC) U15.24(VCC) U16.24(VCC)
BLANK: U1.21(BLANK) U2.21(BLANK) U3.21(BLANK) U4.21(BLANK) U5.21(BLANK) U6.21(BLANK) U7.21(BLANK) U8.21(BLANK) U9.21(BLANK) U10.21(BLANK) U11.21(BLANK) U12.21(BLANK) U13.21(BLANK) U14.21(BLANK) U15.21(BLANK) U16.21(BLANK)
LAT: U1.4(LAT) U2.4(LAT) U3.4(LAT) U4.4(LAT) U5.4(LAT) U6.4(LAT) U7.4(LAT) U8.4(LAT) U9.4(LAT) U10.4(LAT) U11.4(LAT) U12.4(LAT) U13.4(LAT) U14.4(LAT) U15.4(LAT) U16.4(LAT)
SCLK: U1.3(SCLK) U2.3(SCLK) U3.3(SCLK) U4.3(SCLK) U5.3(SCLK) U6.3(SCLK) U7.3(SCLK) U8.3(SCLK) U9.3(SCLK) U10.3(SCLK) U11.3(SCLK) U12.3(SCLK) U13.3(SCLK) U14.3(SCLK) U15.3(SCLK) U16.3(SCLK)
SIN: U13.2(SIN)
SOUT: U4.22(SOUT)
Net-(LED1-1): LED1.1(K) U1.20(OUT15)
Net-(LED2-1): LED2.1(K) U1.19(OUT14)
Net-(LED3-1): LED3.1(K) U1.18(OUT13)
Net-(LED4-1): LED4.1(K) U1.17(OUT12)
Net-(LED5-1): LED5.1(K) U1.16(OUT11)
Net-(LED6-1): LED6.1(K) U1.15(OUT10)
Net-(LED7-1): LED7.1(K) U1.14(OUT9)
Net-(LED8-1): LED8.1(K) U1.13(OUT8)
Net-(LED9-1): LED9.1(K) U2.20(OUT15)
Net-(LED10-1): LED10.1(K) U2.19(OUT14)
Net-(LED11-1): LED11.1(K) U2.18(OUT13)
Net-(LED12-1): LED12.1(K) U2.17(OUT12)
Net-(LED13-1): LED13.1(K) U2.16(OUT11)
Net-(LED14-1): LED14.1(K) U2.15(OUT10)
Net-(LED15-1): LED15.1(K) U2.14(OUT9)
Net-(LED16-1): LED16.1(K) U2.13(OUT8)
Net-(LED17-1): LED17.1(K) U3.20(OUT15)
Net-(LED18-1): LED18.1(K) U3.19(OUT14)
Net-(LED19-1): LED19.1(K) U3.18(OUT13)
Net-(LED20-1): LED20.1(K) U3.17(OUT12)
Net-(LED21-1): LED21.1(K) U3.16(OUT11)
Net-(LED22-1): LED22.1(K) U3.15(OUT10)
Net-(LED23-1): LED23.1(K) U3.14(OUT9)
Net-(LED24-1): LED24.1(K) U3.13(OUT8)
Net-(LED25-1): LED25.1(K) U4.20(OUT15)
Net-(LED26-1): LED26.1(K) U4.19(OUT14)
Net-(LED27-1): LED27.1(K) U4.18(OUT13)
Net-(LED28-1): LED28.1(K) U4.17(OUT12)
Net-(LED29-1): LED29.1(K) U4.16(OUT11)
Net-(LED30-1): LED30.1(K) U4.15(OUT10)
Net-(LED31-1): LED31.1(K) U4.14(OUT9)
Net-(LED32-1): LED32.1(K) U4.13(OUT8)
Net-(LED33-1): LED33.1(K) U1.5(OUT0)
Net-(LED34-1): LED34.1(K) U1.6(OUT1)
Net-(LED35-1): LED35.1(K) U1.7(OUT2)
Net-(LED36-1): LED36.1(K) U1.8(OUT3)
Net-(LED37-1): LED37.1(K) U1.9(OUT4)
Net-(LED38-1): LED38.1(K) U1.10(OUT5)
Net-(LED39-1): LED39.1(K) U1.11(OUT6)
Net-(LED40-1): LED40.1(K) U1.12(OUT7)
Net-(LED41-1): LED41.1(K) U2.5(OUT0)
Net-(LED42-1): LED42.1(K) U2.6(OUT1)
Net-(LED43-1): LED43.1(K) U2.7(OUT2)
Net-(LED44-1): LED44.1(K) U2.8(OUT3)
Net-(LED45-1): LED45.1(K) U2.9(OUT4)
Net-(LED46-1): LED46.1(K) U2.10(OUT5)
Net-(LED47-1): LED47.1(K) U2.11(OUT6)
Net-(LED48-1): LED48.1(K) U2.12(OUT7)
Net-(LED49-1): LED49.1(K) U3.5(OUT0)
Net-(LED50-1): LED50.1(K) U3.6(OUT1)
Net-(LED51-1): LED51.1(K) U3.7(OUT2)
Net-(LED52-1): LED52.1(K) U3.8(OUT3)
Net-(LED53-1): LED53.1(K) U3.9(OUT4)
Net-(LED54-1): LED54.1(K) U3.10(OUT5)
Net-(LED55-1): LED55.1(K) U3.11(OUT6)
Net-(LED56-1): LED56.1(K) U3.12(OUT7)
Net-(LED57-1): LED57.1(K) U4.5(OUT0)
Net-(LED58-1): LED58.1(K) U4.6(OUT1)
Net-(LED59-1): LED59.1(K) U4.7(OUT2)
Net-(LED60-1): LED60.1(K) U4.8(OUT3)
Net-(LED61-1): LED61.1(K) U4.9(OUT4)
Net-(LED62-1): LED62.1(K) U4.10(OUT5)
Net-(LED63-1): LED63.1(K) U4.11(OUT6)
Net-(LED64-1): LED64.1(K) U4.12(OUT7)
Net-(LED65-1): LED65.1(K) U5.20(OUT15)
Net-(LED66-1): LED66.1(K) U5.19(OUT14)
Net-(LED67-1): LED67.1(K) U5.18(OUT13)
Net-(LED68-1): LED68.1(K) U5.17(OUT12)
Net-(LED69-1): LED69.1(K) U5.16(OUT11)
Net-(LED70-1): LED70.1(K) U5.15(OUT10)
Net-(LED71-1): LED71.1(K) U5.14(OUT9)
Net-(LED72-1): LED72.1(K) U5.13(OUT8)
Net-(LED73-1): LED73.1(K) U6.20(OUT15)
Net-(LED74-1): LED74.1(K) U6.19(OUT14)
Net-(LED75-1): LED75.1(K) U6.18(OUT13)
Net-(LED76-1): LED76.1(K) U6.17(OUT12)
Net-(LED77-1): LED77.1(K) U6.16(OUT11)
Net-(LED78-1): LED78.1(K) U6.15(OUT10)
Net-(LED79-1): LED79.1(K) U6.14(OUT9)
Net-(LED80-1): LED80.1(K) U6.13(OUT8)
Net-(LED81-1): LED81.1(K) U7.20(OUT15)
Net-(LED82-1): LED82.1(K) U7.19(OUT14)
Net-(LED83-1): LED83.1(K) U7.18(OUT13)
Net-(LED84-1): LED84.1(K) U7.17(OUT12)
Net-(LED85-1): LED85.1(K) U7.16(OUT11)
Net-(LED86-1): LED86.1(K) U7.15(OUT10)
Net-(LED87-1): LED87.1(K) U7.14(OUT9)
Net-(LED88-1): LED88.1(K) U7.13(OUT8)
Net-(LED89-1): LED89.1(K) U8.20(OUT15)
Net-(LED90-1): LED90.1(K) U8.19(OUT14)
Net-(LED91-1): LED91.1(K) U8.18(OUT13)
Net-(LED92-1): LED92.1(K) U8.17(OUT12)
Net-(LED93-1): LED93.1(K) U8.16(OUT11)
Net-(LED94-1): LED94.1(K) U8.15(OUT10)
Net-(LED95-1): LED95.1(K) U8.14(OUT9)
Net-(LED96-1): LED96.1(K) U8.13(OUT8)
Net-(LED97-1): LED97.1(K) U5.5(OUT0)
Net-(LED98-1): LED98.1(K) U5.6(OUT1)
Net-(LED99-1): LED99.1(K) U5.7(OUT2)
Net-(LED100-1): LED100.1(K) U5.8(OUT3)
Net-(LED101-1): LED101.1(K) U5.9(OUT4)
Net-(LED102-1): LED102.1(K) U5.10(OUT5)
Net-(LED103-1): LED103.1(K) U5.11(OUT6)
Net-(LED104-1): LED104.1(K) U5.12(OUT7)
Net-(LED105-1): LED105.1(K) U6.5(OUT0)
Net-(LED106-1): LED106.1(K) U6.6(OUT1)
Net-(LED107-1): LED107.1(K) U6.7(OUT2)
Net-(LED108-1): LED108.1(K) U6.8(OUT3)
Net-(LED109-1): LED109.1(K) U6.9(OUT4)
Net-(LED110-1): LED110.1(K) U6.10(OUT5)
Net-(LED111-1): LED111.1(K) U6.11(OUT6)
Net-(LED112-1): LED112.1(K) U6.12(OUT7)
Net-(LED113-1): LED113.1(K) U7.5(OUT0)
Net-(LED114-1): LED114.1(K) U7.6(OUT1)
Net-(LED115-1): LED115.1(K) U7.7(OUT2)
Net-(LED116-1): LED116.1(K) U7.8(OUT3)
Net-(LED117-1): LED117.1(K) U7.9(OUT4)
Net-(LED118-1): LED118.1(K) U7.10(OUT5)
Net-(LED119-1): LED119.1(K) U7.11(OUT6)
Net-(LED120-1): LED120.1(K) U7.12(OUT7)
Net-(LED121-1): LED121.1(K) U8.5(OUT0)
Net-(LED122-1): LED122.1(K) U8.6(OUT1)
Net-(LED123-1): LED123.1(K) U8.7(OUT2)
Net-(LED124-1): LED124.1(K) U8.8(OUT3)
Net-(LED125-1): LED125.1(K) U8.9(OUT4)
Net-(LED126-1): LED126.1(K) U8.10(OUT5)
Net-(LED127-1): LED127.1(K) U8.11(OUT6)
Net-(LED128-1): LED128.1(K) U8.12(OUT7)
Net-(LED129-1): LED129.1(K) U9.20(OUT15)
Net-(LED130-1): LED130.1(K) U9.19(OUT14)
Net-(LED131-1): LED131.1(K) U9.18(OUT13)
Net-(LED132-1): LED132.1(K) U9.17(OUT12)
Net-(LED133-1): LED133.1(K) U9.16(OUT11)
Net-(LED134-1): LED134.1(K) U9.15(OUT10)
Net-(LED135-1): LED135.1(K) U9.14(OUT9)
Net-(LED136-1): LED136.1(K) U9.13(OUT8)
Net-(LED137-1): LED137.1(K) U10.20(OUT15)
Net-(LED138-1): LED138.1(K) U10.19(OUT14)
Net-(LED139-1): LED139.1(K) U10.18(OUT13)
Net-(LED140-1): LED140.1(K) U10.17(OUT12)
Net-(LED141-1): LED141.1(K) U10.16(OUT11)
Net-(LED142-1): LED142.1(K) U10.15(OUT10)
Net-(LED143-1): LED143.1(K) U10.14(OUT9)
Net-(LED144-1): LED144.1(K) U10.13(OUT8)
Net-(LED145-1): LED145.1(K) U11.20(OUT15)
Net-(LED146-1): LED146.1(K) U11.19(OUT14)
Net-(LED147-1): LED147.1(K) U11.18(OUT13)
Net-(LED148-1): LED148.1(K) U11.17(OUT12)
Net-(LED149-1): LED149.1(K) U11.16(OUT11)
Net-(LED150-1): LED150.1(K) U11.15(OUT10)
Net-(LED151-1): LED151.1(K) U11.14(OUT9)
Net-(LED152-1): LED152.1(K) U11.13(OUT8)
Net-(LED153-1): LED153.1(K) U12.20(OUT15)
Net-(LED154-1): LED154.1(K) U12.19(OUT14)
Net-(LED155-1): LED155.1(K) U12.18(OUT13)
Net-(LED156-1): LED156.1(K) U12.17(OUT12)
Net-(LED157-1): LED157.1(K) U12.16(OUT11)
Net-(LED158-1): LED158.1(K) U12.15(OUT10)
Net-(LED159-1): LED159.1(K) U12.14(OUT9)
Net-(LED160-1): LED160.1(K) U12.13(OUT8)
Net-(LED161-1): LED161.1(K) U9.5(OUT0)
Net-(LED162-1): LED162.1(K) U9.6(OUT1)
Net-(LED163-1): LED163.1(K) U9.7(OUT2)
Net-(LED164-1): LED164.1(K) U9.8(OUT3)
Net-(LED165-1): LED165.1(K) U9.9(OUT4)
Net-(LED166-1): LED166.1(K) U9.10(OUT5)
Net-(LED167-1): LED167.1(K) U9.11(OUT6)
Net-(LED168-1): LED168.1(K) U9.12(OUT7)
Net-(LED169-1): LED169.1(K) U10.5(OUT0)
Net-(LED170-1): LED170.1(K) U10.6(OUT1)
Net-(LED171-1): LED171.1(K) U10.7(OUT2)
Net-(LED172-1): LED172.1(K) U10.8(OUT3)
Net-(LED173-1): LED173.1(K) U10.9(OUT4)
Net-(LED174-1): LED174.1(K) U10.10(OUT5)
Net-(LED175-1): LED175.1(K) U10.11(OUT6)
Net-(LED176-1): LED176.1(K) U10.12(OUT7)
Net-(LED177-1): LED177.1(K) U11.5(OUT0)
Net-(LED178-1): LED178.1(K) U11.6(OUT1)
Net-(LED179-1): LED179.1(K) U11.7(OUT2)
Net-(LED180-1): LED180.1(K) U11.8(OUT3)
Net-(LED181-1): LED181.1(K) U11.9(OUT4)
Net-(LED182-1): LED182.1(K) U11.10(OUT5)
Net-(LED183-1): LED183.1(K) U11.11(OUT6)
Net-(LED184-1): LED184.1(K) U11.12(OUT7)
Net-(LED185-1): LED185.1(K) U12.5(OUT0)
Net-(LED186-1): LED186.1(K) U12.6(OUT1)
Net-(LED187-1): LED187.1(K) U12.7(OUT2)
Net-(LED188-1): LED188.1(K) U12.8(OUT3)
Net-(LED189-1): LED189.1(K) U12.9(OUT4)
Net-(LED190-1): LED190.1(K) U12.10(OUT5)
Net-(LED191-1): LED191.1(K) U12.11(OUT6)
Net-(LED192-1): LED192.1(K) U12.12(OUT7)
Net-(LED193-1): LED193.1(K) U13.20(OUT15)
Net-(LED194-1): LED194.1(K) U13.19(OUT14)
Net-(LED195-1): LED195.1(K) U13.18(OUT13)
Net-(LED196-1): LED196.1(K) U13.17(OUT12)
Net-(LED197-1): LED197.1(K) U13.16(OUT11)
Net-(LED198-1): LED198.1(K) U13.15(OUT10)
Net-(LED199-1): LED199.1(K) U13.14(OUT9)
Net-(LED200-1): LED200.1(K) U13.13(OUT8)
Net-(LED201-1): LED201.1(K) U14.20(OUT15)
Net-(LED202-1): LED202.1(K) U14.19(OUT14)
Net-(LED203-1): LED203.1(K) U14.18(OUT13)
Net-(LED204-1): LED204.1(K) U14.17(OUT12)
Net-(LED205-1): LED205.1(K) U14.16(OUT11)
Net-(LED206-1): LED206.1(K) U14.15(OUT10)
Net-(LED207-1): LED207.1(K) U14.14(OUT9)
Net-(LED208-1): LED208.1(K) U14.13(OUT8)
Net-(LED209-1): LED209.1(K) U15.20(OUT15)
Net-(LED210-1): LED210.1(K) U15.19(OUT14)
Net-(LED211-1): LED211.1(K) U15.18(OUT13)
Net-(LED212-1): LED212.1(K) U15.17(OUT12)
Net-(LED213-1): LED213.1(K) U15.16(OUT11)
Net-(LED214-1): LED214.1(K) U15.15(OUT10)
Net-(LED215-1): LED215.1(K) U15.14(OUT9)
Net-(LED216-1): LED216.1(K) U15.13(OUT8)
Net-(LED217-1): LED217.1(K) U16.20(OUT15)
Net-(LED218-1): LED218.1(K) U16.19(OUT14)
Net-(LED219-1): LED219.1(K) U16.18(OUT13)
Net-(LED220-1): LED220.1(K) U16.17(OUT12)
Net-(LED221-1): LED221.1(K) U16.16(OUT11)
Net-(LED222-1): LED222.1(K) U16.15(OUT10)
Net-(LED223-1): LED223.1(K) U16.14(OUT9)
Net-(LED224-1): LED224.1(K) U16.13(OUT8)
Net-(LED225-1): LED225.1(K) U13.5(OUT0)
Net-(LED226-1): LED226.1(K) U13.6(OUT1)
Net-(LED227-1): LED227.1(K) U13.7(OUT2)
Net-(LED228-1): LED228.1(K) U13.8(OUT3)
Net-(LED229-1): LED229.1(K) U13.9(OUT4)
Net-(LED230-1): LED230.1(K) U13.10(OUT5)
Net-(LED231-1): LED231.1(K) U13.11(OUT6)
Net-(LED232-1): LED232.1(K) U13.12(OUT7)
Net-(LED233-1): LED233.1(K) U14.5(OUT0)
Net-(LED234-1): LED234.1(K) U14.6(OUT1)
Net-(LED235-1): LED235.1(K) U14.7(OUT2)
Net-(LED236-1): LED236.1(K) U14.8(OUT3)
Net-(LED237-1): LED237.1(K) U14.9(OUT4)
Net-(LED238-1): LED238.1(K) U14.10(OUT5)
Net-(LED239-1): LED239.1(K) U14.11(OUT6)
Net-(LED240-1): LED240.1(K) U14.12(OUT7)
Net-(LED241-1): LED241.1(K) U15.5(OUT0)
Net-(LED242-1): LED242.1(K) U15.6(OUT1)
Net-(LED243-1): LED243.1(K) U15.7(OUT2)
Net-(LED244-1): LED244.1(K) U15.8(OUT3)
Net-(LED245-1): LED245.1(K) U15.9(OUT4)
Net-(LED246-1): LED246.1(K) U15.10(OUT5)
Net-(LED247-1): LED247.1(K) U15.11(OUT6)
Net-(LED248-1): LED248.1(K) U15.12(OUT7)
Net-(LED249-1): LED249.1(K) U16.5(OUT0)
Net-(LED250-1): LED250.1(K) U16.6(OUT1)
Net-(LED251-1): LED251.1(K) U16.7(OUT2)
Net-(LED252-1): LED252.1(K) U16.8(OUT3)
Net-(LED253-1): LED253.1(K) U16.9(OUT4)
Net-(LED254-1): LED254.1(K) U16.10(OUT5)
Net-(LED255-1): LED255.1(K) U16.11(OUT6)
Net-(LED256-1): LED256.1(K) U16.12(OUT7)
Net-(R1-1): R1.1 U1.23(IREF)
Net-(R2-1): R2.1 U2.23(IREF)
Net-(R3-1): R3.1 U3.23(IREF)
Net-(R4-1): R4.1 U4.23(IREF)
Net-(R5-1): R5.1 U5.23(IREF)
Net-(R6-1): R6.1 U6.23(IREF)
Net-(R7-1): R7.1 U7.23(IREF)
Net-(R8-1): R8.1 U8.23(IREF)
Net-(R9-1): R9.1 U9.23(IREF)
Net-(R10-1): R10.1 U10.23(IREF)
Net-(R11-1): R11.1 U11.23(IREF)
Net-(R12-1): R12.1 U12.23(IREF)
Net-(R13-1): R13.1 U13.23(IREF)
Net-(R14-1): R14.1 U14.23(IREF)
Net-(R15-1): R15.1 U15.23(IREF)
Net-(R16-1): R16.1 U16.23(IREF)
Net-(U1-2): U1.2(SIN) U8.22(SOUT)
Net-(U1-22): U1.22(SOUT) U2.2(SIN)
Net-(U2-22): U2.22(SOUT) U3.2(SIN)
Net-(U3-22): U3.22(SOUT) U4.2(SIN)
Net-(U5-2): U5.2(SIN) U12.22(SOUT)
Net-(U5-22): U5.22(SOUT) U6.2(SIN)
Net-(U6-22): U6.22(SOUT) U7.2(SIN)
Net-(U7-22): U7.22(SOUT) U8.2(SIN)
Net-(U9-2): U9.2(SIN) U16.22(SOUT)
Net-(U9-22): U9.22(SOUT) U10.2(SIN)
Net-(U10-22): U10.22(SOUT) U11.2(SIN)
Net-(U11-22): U11.22(SOUT) U12.2(SIN)
Net-(U13-22): U13.22(SOUT) U14.2(SIN)
Net-(U14-22): U14.22(SOUT) U15.2(SIN)
Net-(U15-22): U15.22(SOUT) U16.2(SIN)

## Notes on the sheet
- Extra decoupling & counterweight
